# EAGLE design LWK2_MainBoard_Rev_1 (EAGLE 7.6.0)
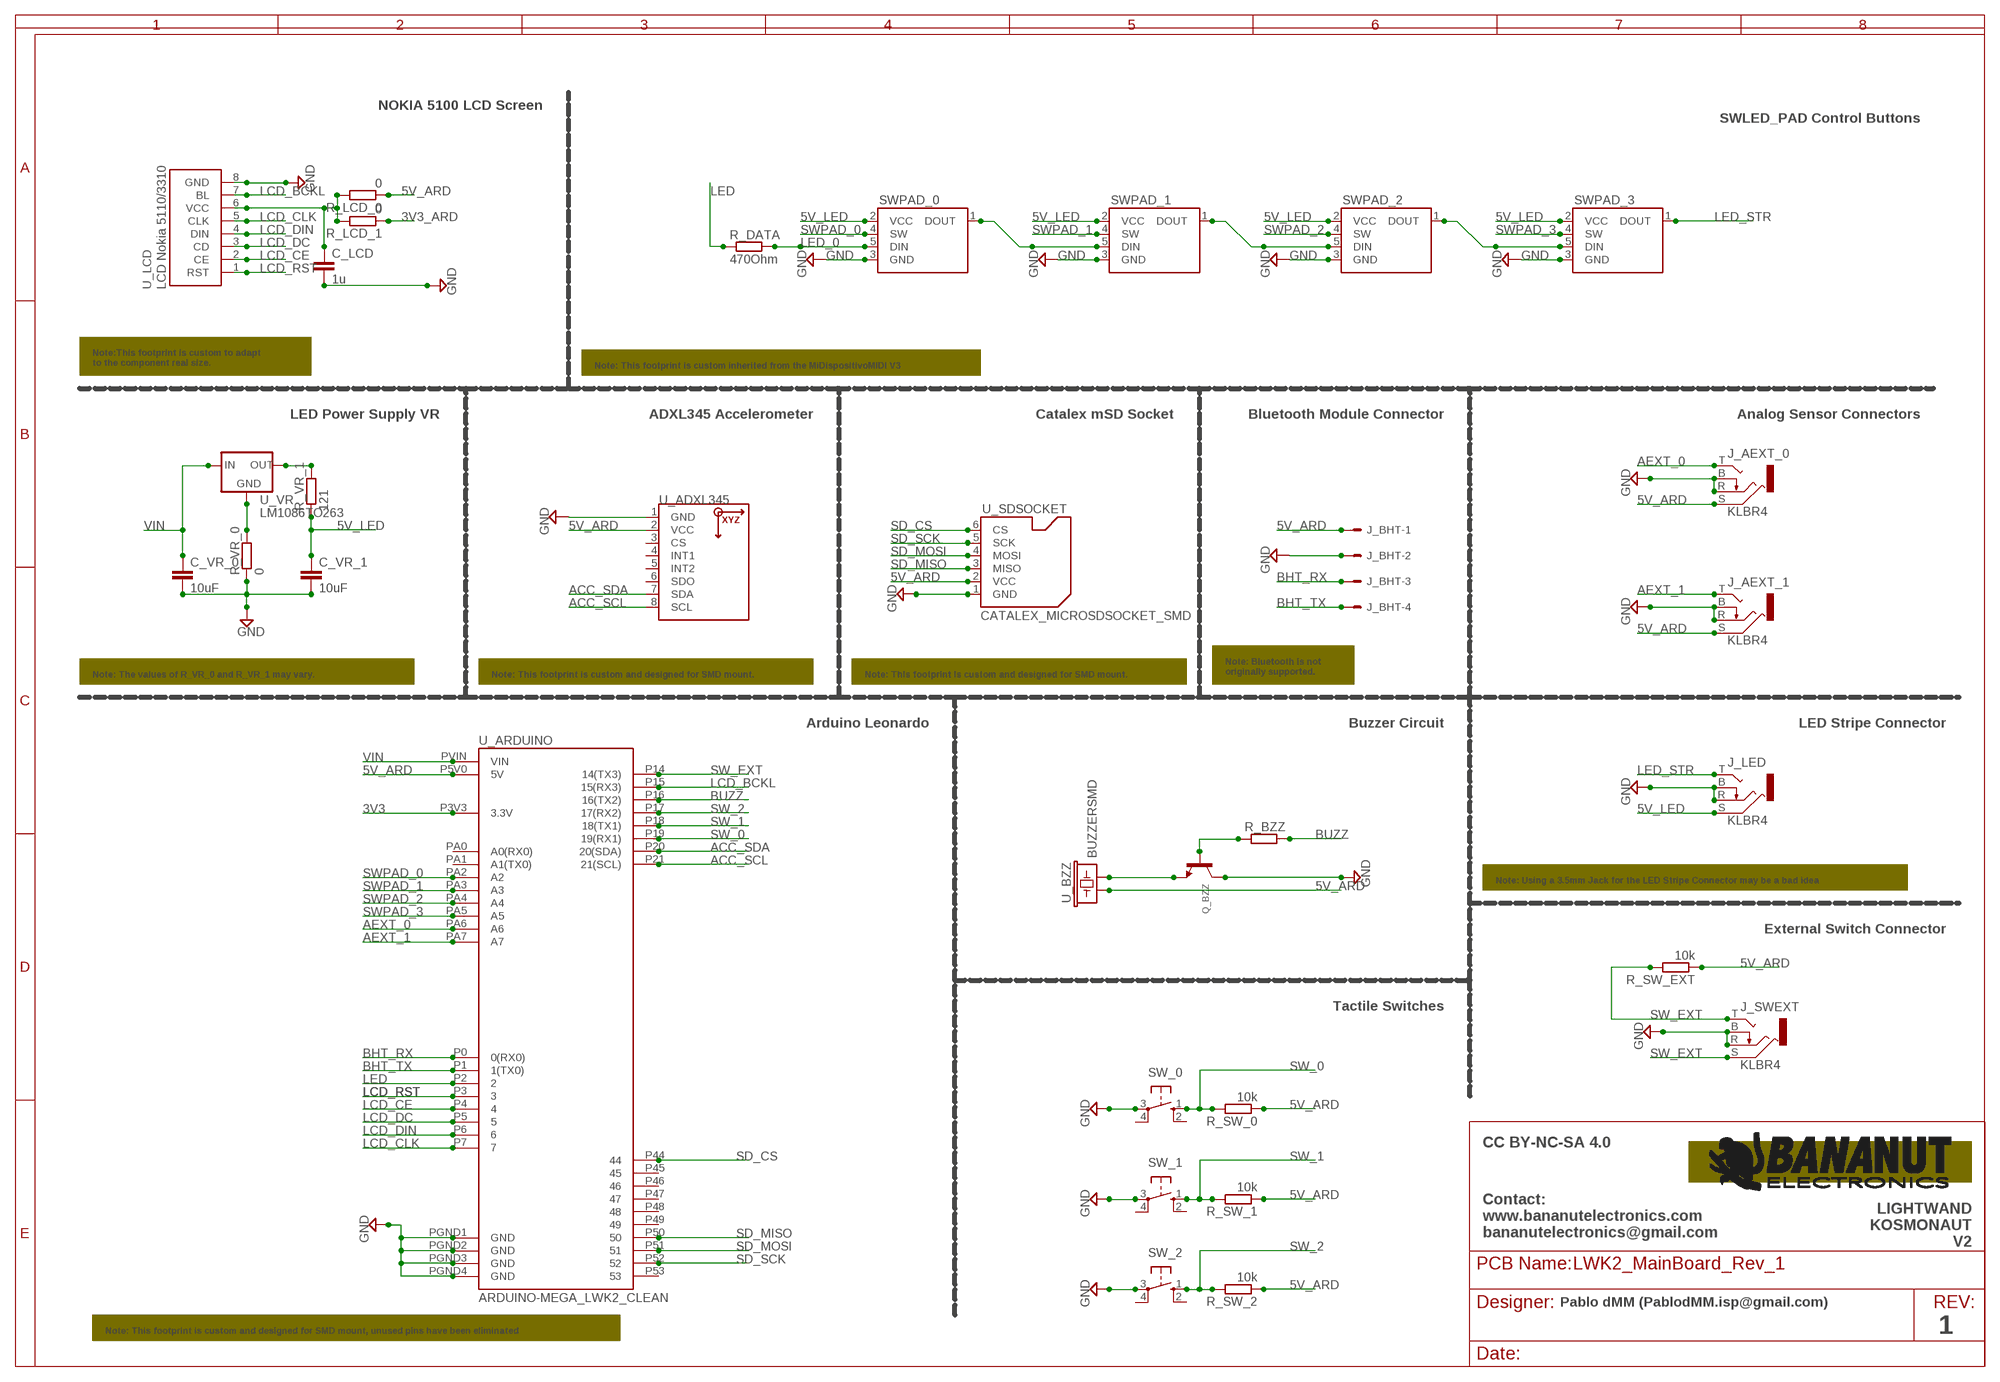
[diagram p0: schematic, sheet 1]

## Parts
C_LCD  1u  C-EUC1206  [C1206]
C_VR_0  10uF  C-EUC1206  [C1206]
C_VR_1  10uF  C-EUC1206  [C1206]
J_AEXT_0  KLBR4  [KLBR4]
J_AEXT_1  KLBR4  [KLBR4]
J_BHT  22-05-7048-04  [7395-04]
J_LED  KLBR4  [KLBR4]
J_SWEXT  KLBR4  [KLBR4]
Q_BZZ  TRANSISTOR_NPNWIDE  [SOT23-WIDE]
R_BZZ  R-EU_R1206  [R1206]
R_DATA  470Ohm  R-EU_R1206  [R1206]
R_LCD_0  0  R-EU_R1206  [R1206]
R_LCD_1  0  R-EU_R1206  [R1206]
R_SW_0  10k  R-EU_R1206  [R1206]
R_SW_1  10k  R-EU_R1206  [R1206]
R_SW_2  10k  R-EU_R1206  [R1206]
R_SW_EXT  10k  R-EU_R1206  [R1206]
R_VR_0  0  R-EU_R1206  [R1206]
R_VR_1  121  R-EU_R1206  [R1206]
SW_0  40-XX-ROUND  [B3F-40XX-ROUND]
SW_1  40-XX-ROUND  [B3F-40XX-ROUND]
SW_2  40-XX-ROUND  [B3F-40XX-ROUND]
SWPAD_0  MDM_V3_LEDPAD  [MDM_V3_LEDPAD]
SWPAD_1  MDM_V3_LEDPAD  [MDM_V3_LEDPAD]
SWPAD_2  MDM_V3_LEDPAD  [MDM_V3_LEDPAD]
SWPAD_3  MDM_V3_LEDPAD  [MDM_V3_LEDPAD]
U_ADXL345  GY-291_ADXL345  [GY-291_ADXL345]
U_ARDUINO  ARDUINO-MEGA_LWK2_CLEAN  [ARDUINO_MEGA_LWK2_CLEAN]
U_BZZ  BUZZERSMD  [BUZZER-CMT1603]
U_LCD  NOKIA5110  [NOKIA5110]
U_SDSOCKET  CATALEX_MICROSDSOCKET_SMD  [CATALEX_MICROSDSOCKET_SMD]
U_VR  LM1086TO263  [TO263]

## Nets
3V3: U_ARDUINO.P3V3(3.3V)
3V3_ARD: R_LCD_1.1
5V_ARD: J_AEXT_0.S J_AEXT_1.S J_BHT.1 R_LCD_0.1 R_SW_0.1 R_SW_1.1 R_SW_2.1 R_SW_EXT.1 U_ADXL345.2(VCC) U_ARDUINO.P5V0(5V) U_BZZ.P$1 U_SDSOCKET.2(VCC)
5V_LED: C_VR_1.1 J_LED.S R_VR_1.1 SWPAD_0.2(VCC) SWPAD_1.2(VCC) SWPAD_2.2(VCC) SWPAD_3.2(VCC)
ACC_SCL: U_ADXL345.8(SCL) U_ARDUINO.P21(21(SCL))
ACC_SDA: U_ADXL345.7(SDA) U_ARDUINO.P20(20(SDA))
AEXT_0: J_AEXT_0.T U_ARDUINO.PA6(A6)
AEXT_1: J_AEXT_1.T U_ARDUINO.PA7(A7)
BHT_RX: J_BHT.3 U_ARDUINO.P0(0(RX0))
BHT_TX: J_BHT.4 U_ARDUINO.P1(1(TX0))
BUZZ: R_BZZ.2 U_ARDUINO.P16(16(TX2))
GND [GND]: C_LCD.2 C_VR_0.2 C_VR_1.2 J_AEXT_0.B J_AEXT_0.R J_AEXT_1.B J_AEXT_1.R J_BHT.2 J_LED.B J_LED.R J_SWEXT.B J_SWEXT.R Q_BZZ.3(C) R_VR_0.1 SW_0.3(P) SW_1.3(P) SW_2.3(P) SWPAD_0.3(GND) SWPAD_1.3(GND) SWPAD_2.3(GND) SWPAD_3.3(GND) U_ADXL345.1(GND) U_ARDUINO.PGND1(GND) U_ARDUINO.PGND2(GND) U_ARDUINO.PGND3(GND) U_ARDUINO.PGND4(GND) U_LCD.8(GND) U_SDSOCKET.1(GND)
LCD_BCKL: U_ARDUINO.P15(15(RX3)) U_LCD.7(BL)
LCD_CE: U_ARDUINO.P4 U_LCD.2(CE)
LCD_CLK: U_ARDUINO.P7 U_LCD.5(CLK)
LCD_DC: U_ARDUINO.P5 U_LCD.3(CD)
LCD_DIN: U_ARDUINO.P6 U_LCD.4(DIN)
LCD_PW: C_LCD.1 R_LCD_0.2 R_LCD_1.2 U_LCD.6(VCC)
LCD_RST: U_ARDUINO.P3 U_LCD.1(RST)
LED: R_DATA.1 U_ARDUINO.P2
LED_0: R_DATA.2 SWPAD_0.5(DIN)
LED_1: SWPAD_0.1(DOUT) SWPAD_1.5(DIN)
LED_2: SWPAD_1.1(DOUT) SWPAD_2.5(DIN)
LED_3: SWPAD_2.1(DOUT) SWPAD_3.5(DIN)
LED_STR: J_LED.T SWPAD_3.1(DOUT)
N$1: R_VR_0.2 U_VR.1(GND)
N$2: R_VR_1.2 U_VR.2(OUT)
N$4: Q_BZZ.2(E) U_BZZ.P$2
N$8: Q_BZZ.1(B) R_BZZ.1
SD_CS: U_ARDUINO.P44 U_SDSOCKET.6(CS)
SD_MISO: U_ARDUINO.P50 U_SDSOCKET.3(MISO)
SD_MOSI: U_ARDUINO.P51 U_SDSOCKET.4(MOSI)
SD_SCK: U_ARDUINO.P52 U_SDSOCKET.5(SCK)
SW_0: R_SW_0.2 SW_0.1(S) U_ARDUINO.P19(19(RX1))
SW_1: R_SW_1.2 SW_1.1(S) U_ARDUINO.P18(18(TX1))
SW_2: R_SW_2.2 SW_2.1(S) U_ARDUINO.P17(17(RX2))
SW_EXT: J_SWEXT.S J_SWEXT.T R_SW_EXT.2 U_ARDUINO.P14(14(TX3))
SWPAD_0: SWPAD_0.4(SW) U_ARDUINO.PA2(A2)
SWPAD_1: SWPAD_1.4(SW) U_ARDUINO.PA3(A3)
SWPAD_2: SWPAD_2.4(SW) U_ARDUINO.PA4(A4)
SWPAD_3: SWPAD_3.4(SW) U_ARDUINO.PA5(A5)
VIN [VCC]: C_VR_0.1 U_ARDUINO.PVIN(VIN) U_VR.3(IN)
Unconnected: SW_0.2(S1) SW_0.4(P1) SW_1.2(S1) SW_1.4(P1) SW_2.2(S1) SW_2.4(P1) U_ARDUINO.P45 U_ARDUINO.P46 U_ARDUINO.P47 U_ARDUINO.P48 U_ARDUINO.P49 U_ARDUINO.P53 U_ARDUINO.PA0(A0(RX0)) U_ARDUINO.PA1(A1(TX0))

## Notes on the sheet
- NOKIA 5100 LCD Screen
- SWLED_PAD Control Buttons
- Note:This footprint is custom to adapt
  to the component real size.
- Note: This footprint is custom inherited from the MiDispositivoMIDI V3
- LED Power Supply VR | ADXL345 Accelerometer | Catalex mSD Socket | Bluetooth Module Connector | Analog Sensor Connectors
- Note: Bluetooth is not
  originally supported.
- Note: The values of R_VR_0 and R_VR_1 may vary. | Note: This footprint is custom and designed for SMD mount. | Note: This footprint is custom and designed for SMD mount.
- Arduino Leonardo | Buzzer Circuit | LED Stripe Connector
- Note: Using a 3.5mm Jack for the LED Stripe Connector may be a bad idea
- External Switch Connector
- Tactile Switches
- CC BY-NC-SA 4.0
- LIGHTWAND
  KOSMONAUT
  V2
- Contact:
  www.bananutelectronics.com
  bananutelectronics@gmail.com
- Pablo dMM (PablodMM.isp@gmail.com)
- 1
- Note: This footprint is custom and designed for SMD mount, unused pins have been eliminated

## Power pins joined to a net without a drawn wire
CS: U_ADXL345.3(CS)
INT1: U_ADXL345.4(INT1)
INT2: U_ADXL345.5(INT2)
SDO: U_ADXL345.6(SDO)

## Library data of the parts
C_LCD C_VR_0 C_VR_1 = resistor:C-EU: CAPACITOR, European symbol
J_AEXT_0 J_AEXT_1 J_LED J_SWEXT = con-lumberg:KLBR4: Jack connectors according to JISC 6560, 3.5 mm Klinkeneinbaukupplung nach JISC 6560, 3,5 mm, 3-polig/ stereo, abgewinkelte Ausführung, mit Öffner, für Leiterplatten Source: Data sheet <http://www.lumberg.com/Produkte/PDFs/KLBR4.pdf>; MPN: KLBR 4; OC_FARNELL: 1217016; OC_NEWARK: 97K2709
J_BHT = con-molex:22-?-04: CONNECTOR wire to board 2.54 mm (.1 inch) pitch header; OC_FARNELL: unknown; OC_NEWARK: unknown
Q_BZZ = microbuilder:TRANSISTOR_NPN: NPN Transistor Transistor (NPN) 500mA 45V - BC817 [Digikey: 568-1631-1-ND] Transistor (NPN) 500mA 45V - BC817,215 [Mouser: 771-BC817-T/R] SOT23-R - SOT23 footprint optimised for use with solder paste and reflow ovens. SOT23-W - SOT23 footprint optimised for hand-soldering (larger pads).
R_BZZ R_DATA R_LCD_0 R_LCD_1 R_SW_0 R_SW_1 R_SW_2 R_SW_EXT R_VR_0 R_VR_1 = resistor:R-EU_: RESISTOR, European symbol
SW_0 SW_1 SW_2 = adafruit:40-XX: OMRON SWITCH
SWPAD_0 SWPAD_1-SWPAD_3 = PdMM_Aux:MDM_V3_LEDPAD: WS2812B - Intelligent control LED integrated light source Technical Specifications: Power Supply Voltage (VDD): 3.5 to 5.3 V Input Voltage (VI): -0.5 to VDD+0.5 V Operating Junction Temperature (Topt): -25°C to +80°C Storage Temperature Range (Tstg): -55°C to +150°C; PROD_ID: DIO-12503
U_ADXL345 = PdMM_Aux:GY-291_ADXL345: WS2812B - GY-291_ADXL345 Technical Specifications: GY-291_ADXL345 ACC Module SMD Fix Mount (!!!) Made for LWK2
U_ARDUINO = SparkFun-Boards:ARDUINO-MEGA_LWK2_CLEAN: Arduino Mega board footprint
U_BZZ = SparkFun:BUZZER: Buzzer 12mm Spark Fun Electronics SKU : Comp-Buzzer
U_LCD = _LCD_Nokia5110:NOKIA5110: Monochrome LCD Module from Nokia 5110/3310 with controller PCD8544. 8 pins x 2,54mm on bottom side. 45,5 mm x 42,5 mm
U_SDSOCKET = PdMM_Aux:CATALEX_MICROSDSOCKET_SMD: WS2812B - CATALEX mSD Socket Technical Specifications: CATALEX mSD Socket Made for LWK2
U_VR = v-reg-2:LM1086

## Net classes
1 GND: width 0.635 mm
2 VCC: width 0.889 mm

## Board
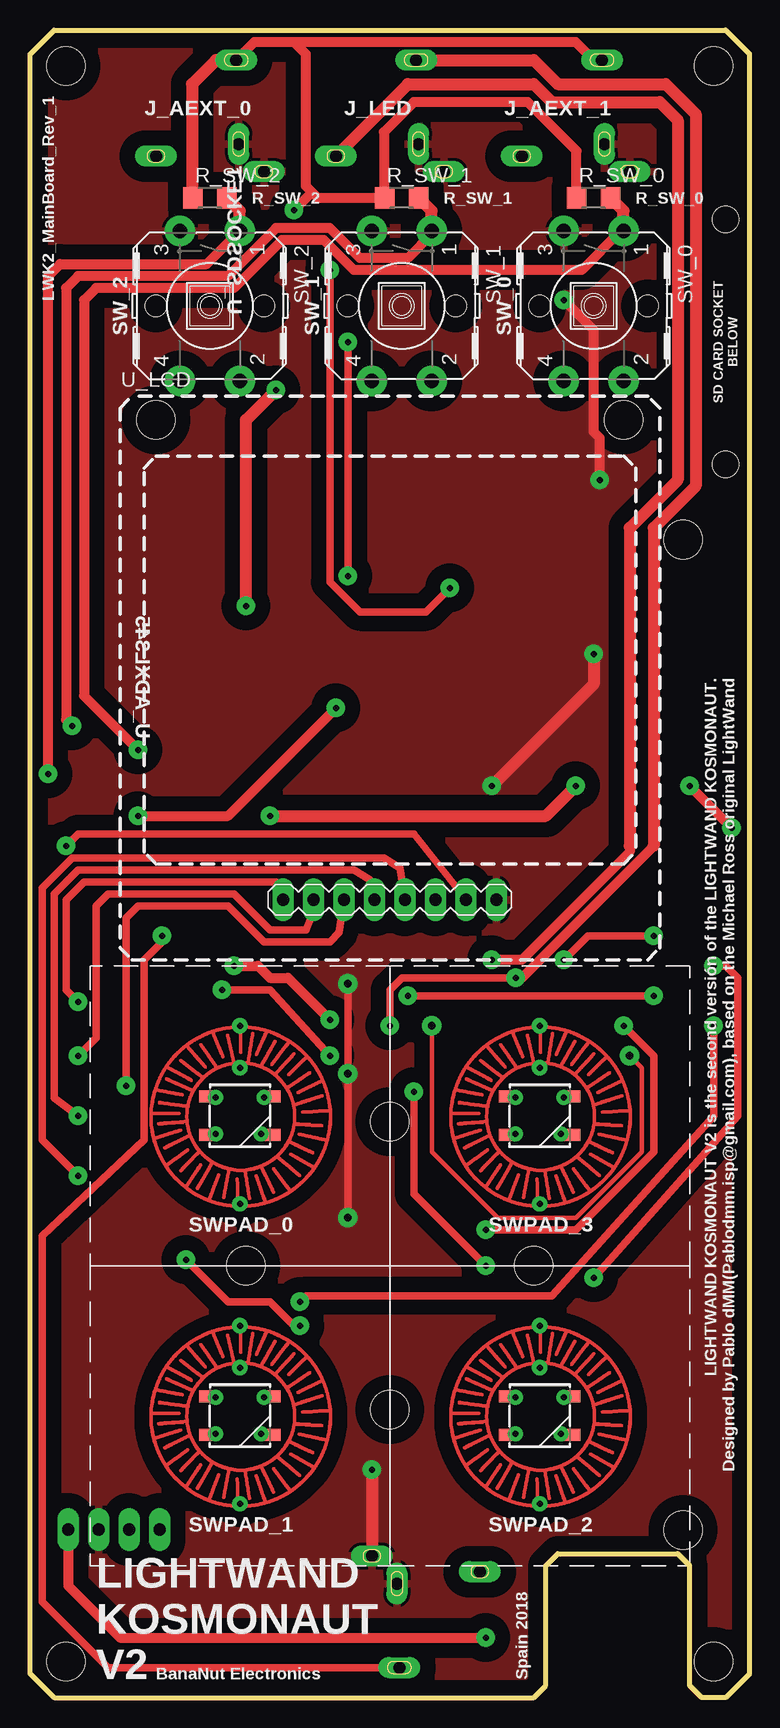
[diagram p1: board, top side]
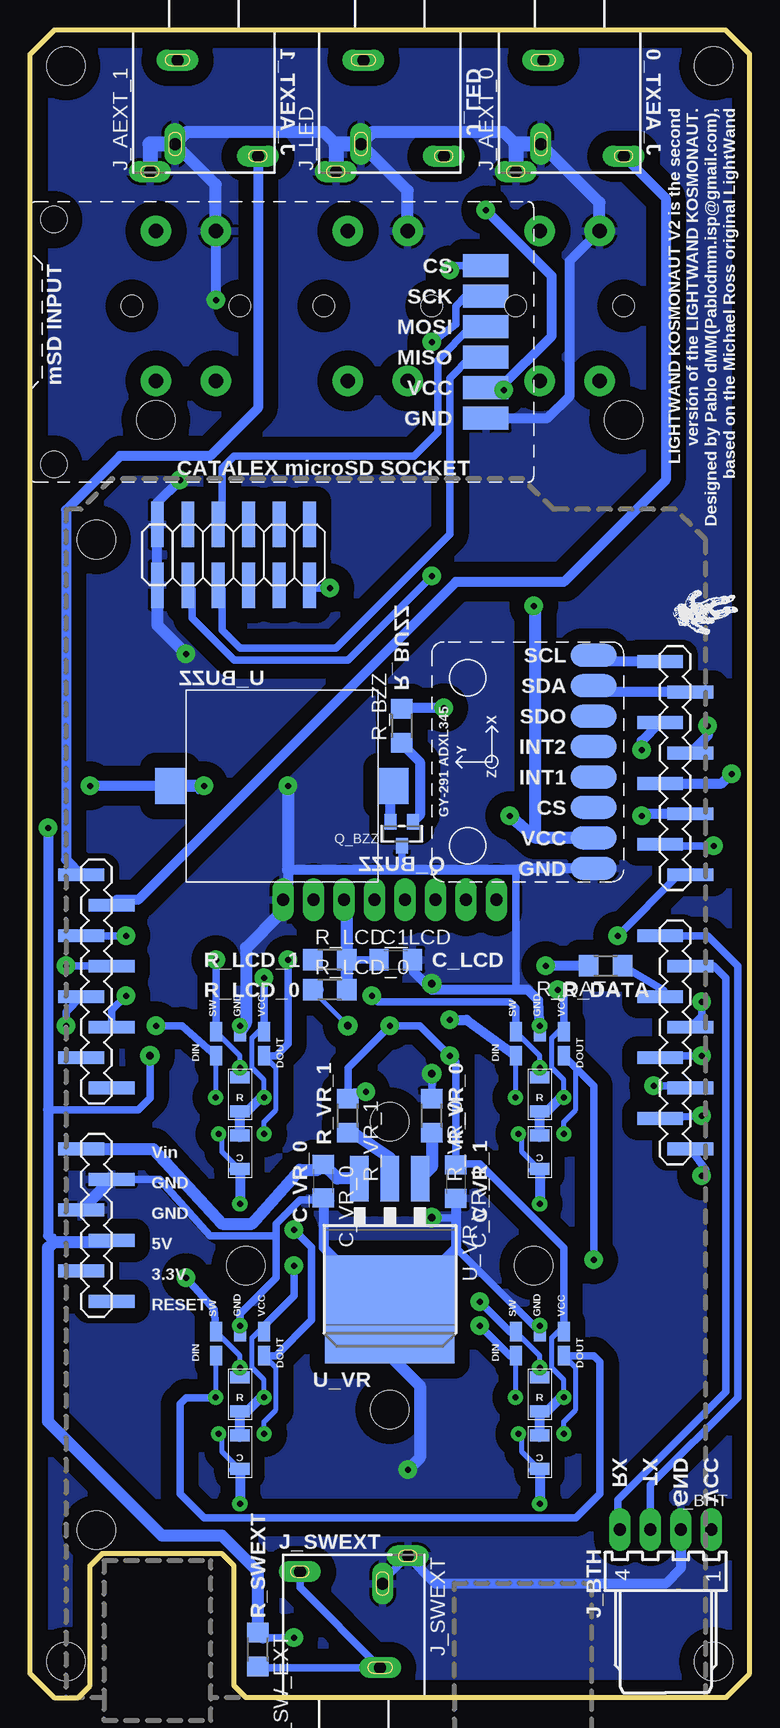
[diagram p2: board, bottom side, seen from below]

Size 60 x 139 mm. Coordinates in mm from the lower left corner, seen from the top.
Outline: 2,0 42,0 43,1 43,11 44,12 54,12 55,11 55,1 56,0 58,0 60,2 60,137 58,139 2,139 0,137 0,2 2,0
Copper layers (1*16): Top 0.035mm / dielectric 1.5mm / Bottom 0.035mm
Design rules "default *": minimum track width 15mil, minimum drill 24mil, track to track 15mil, track to pad 15mil, pad to pad 15mil, via to via 15mil, smd to smd 8mil, copper to edge 40mil, drill to drill 8mil, minimum pad ring 15mil, minimum via ring 20mil, stop-mask expansion 4mil, vias tented up to drill 0mil, thermal gap 10mil
Holes 3.2 mm at 30,24 18,36 42,36 30,48 3,136 57,136 3,3 57,3

### Footprints (pad centres in the part's own frame; a part is rotated, then mirrored left to right if it is on the bottom)
C1206 = smd 1.6 x 1.8: 1 -1.4,0; 2 1.4,0
KLBR4 = drill 1 pad 1.3 long: B -2.4,-3.5; S -2.2,3.5 | drill 1 pad 1.2 long: R -4.5,-5.8; T 4.5,-4.5
7395-04 = drill 1.016 long: 1 3.81,0; 2 1.27,0; 3 -1.27,0; 4 -3.81,0
SOT23-WIDE = smd 1 x 1.27: 1 -0.95,-1; 2 0.95,-1; 3 0,1
R1206 = smd 1.6 x 1.803: 1 -1.422,0; 2 1.422,0
B3F-40XX-ROUND = drill 1.194 pad 2.54: 1 -6.248,2.489; 2 6.248,2.489; 3 -6.248,-2.489; 4 6.248,-2.489 | hole 1.803: 0,-4.496; 0,4.496
MDM_V3_LEDPAD = smd 1 x 1.651 bottom: 1 -2,5; 2 -2,7; 3 0,7; 4 2,7; 5 2,5 | smd 1.651 x 1 bottom: 6 0,-4.44; 7 0,0.37; 8 0,3.17; 9 0,-1.64 | smd 1.651 x 1: A -2.577,1.6; B 2.577,1.6; C -2.577,-1.6; D 2.577,-1.6 | drill 0.5: P$1 0,4; P$2 0,7.5; P$4 -2.032,1.524; P$6 -2.032,-1.524; P$7 2.032,1.524; P$8 1.778,-1.524; P$9 0,-7.366
GY-291_ADXL345 = smd 1.93 x 3.81: 1 8.89,0; 2 6.35,0; 3 3.81,0; 4 1.27,0; 5 -1.27,0; 6 -3.81,0; 7 -6.35,0; 8 -8.89,0
ARDUINO_MEGA_LWK2_CLEAN = smd 1.067 x 3.81 bottom: P0 63.5,49.53; P1 60.96,52.07; P2 58.42,49.53; P3 55.88,52.07; P3V3 35.56,1.27; P4 53.34,49.53; P5 50.8,52.07; P5V0 38.1,3.81; P6 48.26,49.53; P7 45.72,52.07; P14 68.58,52.07; P15 71.12,49.53; P16 73.66,52.07; P17 76.2,49.53; P18 78.74,52.07; P19 81.28,49.53; P20 83.82,52.07; P21 86.36,49.53; PA0 50.8,3.81; PA1 53.34,1.27; PA2 55.88,3.81; PA3 58.42,1.27; PA4 60.96,3.81; PA5 63.5,1.27; PA6 66.04,3.81; PA7 68.58,1.27; PGND1 40.64,1.27; PGND2 43.18,3.81; PRESET 33.02,3.81; PVIN 45.72,1.27 | smd 3.81 x 1.067 bottom: P44 92.71,20.32; P45 97.79,20.32; P46 92.71,17.78; P47 97.79,17.78; P48 92.71,15.24; P49 97.79,15.24; P50 92.71,12.7; P51 97.79,12.7; P52 92.71,10.16; P53 97.79,10.16; PGND3 97.79,7.62; PGND4 92.71,7.62 | hole 3.2: 13.97,2.54; 96.52,2.54
BUZZER-CMT1603 = smd 2.5 x 3: P$1 -9.3,0; P$2 9.3,0
NOKIA5110 = drill 1.016 long: 1 -8.89,-18.5; 2 -6.35,-18.5; 3 -3.81,-18.5; 4 -1.27,-18.5; 5 1.27,-18.5; 6 3.81,-18.5; 7 6.35,-18.5; 8 8.89,-18.5 | hole 3.2: 19.5,21.5; -19.5,21.5
CATALEX_MICROSDSOCKET_SMD = smd 1.93 x 3.81: 1 6.35,0; 2 3.81,0; 3 1.27,0; 4 -1.27,0; 5 -3.81,0; 6 -6.35,0 | hole 2.2: -10.2,-36; 10.2,-36
TO263 = smd 1.524 x 3.81: 1 -2.54,-8.255; 2 0,-8.255; 3 2.54,-8.255 | smd 10.8 x 9: 4 0,2.635

### Placement (x,y rotation side)
C_LCD  29.5,61.5 0 bottom
C_VR_0  35.55,43.05 270 bottom
C_VR_1  24.5,43 270 bottom
J_AEXT_0  15,133 0 bottom
J_AEXT_1  45.5,133 0 bottom
J_BHT  7,14 0 bottom
J_LED  30,133 0 bottom
J_SWEXT  33,6 180 bottom
Q_BZZ  29,72 180 bottom
R_BZZ  29,81 90 bottom
R_DATA  12,61 180 bottom
R_LCD_0  35,59 0 bottom
R_LCD_1  35,61.5 0 bottom
R_SW_0  47,125 0 top
R_SW_1  31,125 0 top
R_SW_2  15,125 0 top
R_SW_EXT  41,4 270 bottom
R_VR_0  26.5,48.5 270 bottom
R_VR_1  33.5,48.5 270 bottom
SW_0  47,116 270 top
SW_1  31,116 270 top
SW_2  15,116 270 top
SWPAD_0  17.5,48.5 0 top
SWPAD_1  17.5,23.5 0 top
SWPAD_2  42.5,23.5 0 top
SWPAD_3  42.5,48.5 0 top
U_ADXL345  13,78 270 bottom
U_ARDUINO  57,0 90 top
U_BZZ  39,76 0 bottom
U_LCD  30,85 0 top
U_SDSOCKET  22,113 270 bottom
U_VR  30,35 180 bottom

### Tracks (layer width: path | path; a pad name or v marks a point on that pad's centre or on a via)
5V_ARD  (via drill 0.5 pad 0.25, 0.61)
  Top 0.381: v33.5,56 33.5,45.5 39,40 45.5,40 51,45.5 51,52.5 v50,53.5
  Top 0.813: v38,5 7.5,5 3.19,9.31 J_BHT.1 | J_AEXT_1.S 47,136.5 45.5,138 22,138 | 22,138 18.7,138 J_AEXT_0.S | 23.5,125.5 24,125 R_SW_1.1 29.5,125.08 29.5,130.5 32,133 41.5,133 45.58,128.92 R_SW_0.1 | 23.5,125.5 23,126 23,137 22,138 | v22,124 23.5,125.5 | v55,76 v58.5,72.5
  Top 1.016: v20,73.5 43,73.5 v45.5,76 | v18,91 18,106.5 v20.5,109 | J_AEXT_0.S 15.5,136.5 13.5,134.5 13.5,125.08 R_SW_2.1
  Bottom 0.381: v33.5,56 36,58.5 R_LCD_0.1 | 58.5,38.5 58,38.5 58,38 | 46,75.5 v45.5,76
  Bottom 0.61: v38,5 40.58,5 | v50,53.5 50,50 51,49 58.5,49
  Bottom 0.813: U_SDSOCKET.2 20.81,109.19 16.5,113.5 16.5,118.5 v22,124 | v45.5,76 v55,76 | v58.5,72.5 58.5,49 58.5,38.5 58,38
  Bottom 1.016: 40.58,5 R_SW_EXT.1 41,10.5 44,13.5 49,13.5 58.5,23 58.5,37.5 58,38 53.29,38 U_ARDUINO.P5V0 | U_ADXL345.2 17.85,71.65 | 17.85,71.65 v20,73.5 | v45.5,76 U_BZZ.P$1 | R_LCD_0.1 36,59 | 17.85,71.65 17.85,90.85 v18,91 | v20.5,109 21.81,109 U_SDSOCKET.2
5V_LED  (via drill 0.5 pad 0.25)
  Top 0.61: v30,56 30,59 31,60 v40.5,60 | v16,59 20,59 v25,53.5 | v38,36 32,42 v32,50.5
  Top 0.813: v40.5,60 41,60 52,71
  Top 1.016: J_LED.S 42,136.5 44,134.5 53,134.5 55.5,132 55.5,101 52,97.5 52,71
  Bottom 0.381: 24.5,44 C_VR_1.1 | 33.5,50 R_VR_1.1
  Bottom 0.61: 33.5,50 33.5,52.5 v30,56 27.5,56 v25,53.5 24.5,53 C_VR_1.1 24.4,44.5 22.5,44.5 15.5,37.5 SWPAD_1.2 | SWPAD_0.2 15.5,58.5 v16,59 | SWPAD_3.2 40.5,59.5 41,60 v40.5,60 | SWPAD_2.2 40.5,31 38,33.5 v38,36 | v32,50.5 32.92,50.5 R_VR_1.1
ACC_SCL
  Bottom 0.813: U_ARDUINO.P21 12.47,86.36 U_ADXL345.8
ACC_SDA
  Bottom 0.813: U_ARDUINO.P20 12.47,83.82 U_ADXL345.7
AEXT_0
  Bottom 0.813: J_AEXT_0.T 7,125 7,101.5 15.5,93 24.5,93 51,66.5 52.73,66.5 U_ARDUINO.PA6
AEXT_1
  Bottom 0.813: J_AEXT_1.T 41,107.5 45,103.5 52.5,103.5 57,99 57,69.85 U_ARDUINO.PA7
BHT_RX
  Bottom 0.61: J_BHT.3 8.27,17.73 1,25 1,61 3.5,63.5 U_ARDUINO.P0
BHT_TX
  Bottom 0.61: U_ARDUINO.P1 2.96,60.96 2,60 2,25.5 11,16.5 11,14.19 J_BHT.4
BUZZ  (via drill 0.5 pad 0.3)
  Top 0.813: v9,73.5 16.5,73.5 v25.5,82.5
  Bottom 0.813: U_ARDUINO.P16 8.84,73.66 v9,73.5 | v25.5,82.5 28.92,82.5 R_BZZ.2
GND  (via drill 0.5 pad 0.25, 0.61)
  Top 0.635: v26.5,40 v26.5,52 v26.5,59.5
  Top 0.813: v47.5,101.5 47.5,105 47,105.5 47,114 v44.5,116.5
  Top 1.016: v28.5,19 J_SWEXT.R | v47,87 47,84.5 v38.5,76
  Bottom 0.61: Q_BZZ.3 29,69 29.5,69 | J_SWEXT.B 30.6,9.7 J_SWEXT.R | 39.5,38.5 39.5,35 42.5,32 SWPAD_2.3 | 39.5,38.5 39.5,39.5 37.5,41.5 35.7,41.5 C_VR_0.2 | U_ARDUINO.PGND2 49.18,43.18 45,38.5 39.5,38.5 | 30,32.5 30,32 30,31 | SWPAD_1.3 24.5,37.5
  Bottom 0.635: v26.5,52 R_VR_0.1 | 24.5,40 v26.5,40 | v26.5,59.5 26.75,59.25 | 19.5,69 19.5,59
  Bottom 0.813: SWPAD_0.3 17.62,58.12 18.5,59 19.5,59 26.5,59 26.75,59.25 28,60.5 28,61.4 C_LCD.2 | U_ADXL345.1 18.89,69.11 19.5,69 29.5,69 38.5,69 38.5,66.94 U_LCD.8 | U_ARDUINO.PGND4 U_ARDUINO.PGND3 49.38,99.62 v47.5,101.5 | J_BHT.2 5.73,10.77 7,9.5 26.2,9.5 J_SWEXT.R | C_VR_1.2 24.5,40 24.5,37.5 30,32 35.5,37.5 35.5,41.6 C_VR_0.2 | v44.5,116.5 44.5,122.24 SW_0.3 | U_SDSOCKET.1 16.85,106.65 15,108.5 15,119.76 SW_2.3
  Bottom 1.016: U_ARDUINO.PGND1 U_ARDUINO.PGND2 | U_LCD.8 39.09,65.41 42,62.5 42,56.23 SWPAD_3.3 | 30,32.5 30,28.5 27.5,26 27.5,20 v28.5,19 | U_ARDUINO.PGND4 49.38,89.38 v47,87 | v38.5,76 38.5,69 | 19.5,129.5 20.5,130.5 31.4,130.5 J_LED.B 28.51,125.61 SW_1.3 | 34.5,129.5 35.5,130.5 46.9,130.5 J_AEXT_1.B 44.51,126.11 SW_0.3 | SW_2.3 12.51,124.61 J_AEXT_0.B
  Bottom 1.27: J_AEXT_0.B 19.5,129.5 J_AEXT_0.R | J_LED.B 34.5,129.5 J_LED.R | J_AEXT_1.B 50,129.5 J_AEXT_1.R
  pour Bottom (isolate 1.27): 2,139 0,137 0,2 2,0 42,0 43,1 43,11 44,12 54,12 55,11 55,1 56,0 58,0 60,2 60,137 58,139
  pour Top (isolate 1.27): 2,139 0,137 0,2 2,0 42,0 43,1 43,11 44,12 54,12 55,11 55,1 56,0 58,0 60,2 60,137 58,139
LCD_BCKL  (via drill 0.5 pad 0.25)
  Top 0.61: U_LCD.7 35.93,67.07 32,72 4,72 v3,71
  Bottom 0.61: v3,71 7.35,71 U_ARDUINO.P15
LCD_CE  (via drill 0.5 pad 0.25)
  Top 0.61: U_LCD.2 23.73,65.73 23,64 20,64 17,67 6.5,67 5.5,66 5.5,55 v4,53.5
  Bottom 0.61: v4,53.5 7.31,53.5 U_ARDUINO.P4
LCD_CLK  (via drill 0.5 pad 0.25)
  Top 0.61: U_LCD.5 30.85,69.15 29.5,70 3.5,70 1,67.5 1,46.5 v4,43.5
  Bottom 0.61: v4,43.5 3.65,44 U_ARDUINO.P7
LCD_DC  (via drill 0.5 pad 0.25)
  Top 0.61: U_LCD.3 25.77,63.77 25,63 19.5,63 16.5,66 9,66 8,65 v8,51
  Bottom 0.61: v8,51 5.13,51 U_ARDUINO.P5
LCD_DIN  (via drill 0.5 pad 0.25)
  Top 0.61: U_LCD.4 28.31,68.19 27,69 4,69 2,67 2,50 v4,48.5
  Bottom 0.61: v4,48.5 4.23,48.5 U_ARDUINO.P6
LCD_PW
  Bottom 0.61: C_LCD.1 33.08,61.5 33.58,61
  Bottom 1.016: R_LCD_0.2 33.58,61 R_LCD_1.2 33.58,65.72 U_LCD.6
LCD_RST  (via drill 0.5 pad 0.25)
  Top 0.61: U_LCD.1 21.09,67.41 20.5,68 4.5,68 3,66.5 3,59 v4,58
  Bottom 0.61: v4,58 4,56.81 U_ARDUINO.P3
LED
  Bottom 0.61: U_ARDUINO.P2 7.16,58.92 R_DATA.1
LED_0  (via drill 0.5 pad 0.25)
  Top 0.813: v17,61 19,61 20,60 21.5,60 v25,56.5
  Bottom 0.813: R_DATA.2 v17,61 | v25,56.5 23.58,56.5 SWPAD_0.5
LED_1  (via drill 0.5 pad 0.25)
  Top 0.61: v22.5,31 22,31 20,33 16.5,33 v13,36.5
  Bottom 0.61: SWPAD_1.5 20,28.5 v22.5,31 | v13,36.5 13,51 SWPAD_0.1
LED_2
  Bottom 0.61: SWPAD_1.1 13,28.5 12.5,28 12.5,17 14.5,15 45.5,15 47.5,17 47.5,24.5 47,25 44.5,25
LED_3  (via drill 0.5 pad 0.25)
  Top 0.61: v38,39 45.5,39 52,45.5 52,53.5 v49.5,56
  Bottom 0.61: v38,39 36.54,37.54 36.54,31.46 39.5,28.5 SWPAD_2.1 | v49.5,56 47.31,56 SWPAD_3.5
LED_STR  (via drill 0.5 pad 0.25)
  Top 0.61: v38.5,61.5 39,61.5
  Top 0.813: 50,71 50,70.5 41,61.5 v38.5,61.5
  Top 1.016: 50,71 50,97.5 54,101.5 54,131.5 52.5,133 43.5,133 42,134.5 31.5,134.5 J_LED.T
  Bottom 0.61: SWPAD_3.1 39.5,53.5 38.5,54.5 v38.5,61.5
N$1
  Bottom 1.016: R_VR_0.2 26.5,44.22 U_VR.1
N$2
  Bottom 1.016: U_VR.2 30,45 32.92,47 R_VR_1.2
N$3
  pour Bottom (isolate 1.27): 2,139 0,137 0,2 2,0 42,0 43,1 43,11 44,12 54,12 55,11 55,1 56,0 58,0 60,2 60,137 58,139
N$4
  Bottom 0.813: Q_BZZ.2 29.95,75.75 U_BZZ.P$2
N$8
  Bottom 0.813: R_BZZ.1 29,79.5 27.5,78 27.5,73.55 Q_BZZ.1
SD_CS  (via drill 0.5 pad 0.25)
  Top 0.61: v25,119 25,93 27.5,90.5 33,90.5 v35,92.5
  Bottom 0.61: U_SDSOCKET.6 24.65,119.35 v25,119 | v35,92.5 36.47,92.5 U_ARDUINO.P44
SD_MISO
  Bottom 0.61: U_SDSOCKET.3 23.27,111.73 25,110 25,97 34.5,87.5 42.5,87.5 44,89 44,92.41 U_ARDUINO.P50
SD_MOSI
  Bottom 0.61: U_SDSOCKET.4 23.23,114.27 26,111.5 26,105.5 28,103.5 43,103.5 44,102.5 44,98.09 U_ARDUINO.P51
SD_SCK  (via drill 0.5 pad 0.25)
  Top 0.61: v26.5,113 v26.5,93.5
  Bottom 0.61: U_SDSOCKET.5 23.69,116.81 24.5,116 24.5,114.5 v26.5,113 | v26.5,93.5 33.5,86.5 43,86.5 46.5,90 46.5,92.37 U_ARDUINO.P52 47,92.55
SW_0  (via drill 0.5 pad 0.25)
  Top 0.813: SW_0.1 49.25,122.25 46,119 27,119 24.5,121.5 21,121.5 17,117.5 5.5,117.5 4.5,116.5 4.5,83.5 v9,79
  Top 1.016: SW_0.1 49.49,123.93 R_SW_0.2
  Bottom 0.813: v9,79 9,79.75 U_ARDUINO.P19
SW_1  (via drill 0.5 pad 0.25)
  Top 0.813: SW_1.1 33.49,121.99 31.5,120 27.5,120 25,122.5 20.5,122.5 16.5,118.5 4,118.5 3,117.5 3,81.5 v3.5,81
  Top 1.016: SW_1.1 33.49,123.93 R_SW_1.2
  Bottom 0.813: v3.5,81 3.5,80.17 U_ARDUINO.P18
SW_2  (via drill 0.5 pad 0.25)
  Top 0.813: v1.5,77 1.5,118.5 2.5,119.5 14.74,119.5 SW_2.1
  Top 1.016: SW_2.1 17.49,123.93 R_SW_2.2
  Bottom 0.813: U_ARDUINO.P17 2.3,76.2 v1.5,77
SW_EXT  (via drill 0.5 pad 0.25)
  Top 0.61: v11,63.5 11,63 9.5,61.5 9.5,46.5 1,38.5 1,8 6.5,2.5 J_SWEXT.S
  Bottom 0.61: R_SW_EXT.2 40.92,2.5 J_SWEXT.S 37.5,9.2 J_SWEXT.T | U_ARDUINO.P14 5.92,68.58 v11,63.5
SWPAD_0  (via drill 0.5 pad 0.25)
  Top 0.61: v52,58.5 v31.5,58.5
  Bottom 0.61: v31.5,58.5 31,58 20,58 19.5,57.5 SWPAD_0.4 | U_ARDUINO.PA2 53.19,57.31 v52,58.5
SWPAD_1  (via drill 0.5 pad 0.25)
  Top 0.61: v57,56 57,48.5 43.5,33.5 23,33.5 v22.5,33
  Bottom 0.61: v57,56 57,57.15 U_ARDUINO.PA3 | SWPAD_1.4 20,30.5 v22.5,33
SWPAD_2  (via drill 0.5 pad 0.25)
  Top 0.61: v47,35 59,48.5 59,60 58,61 v57,61
  Bottom 0.61: SWPAD_2.4 44.66,32.34 v47,35 | v57,61 53.23,61 U_ARDUINO.PA4
SWPAD_3  (via drill 0.5 pad 0.25)
  Top 0.61: v52,63.5 46.5,63.5 v44.5,61.5
  Bottom 0.61: U_ARDUINO.PA5 v52,63.5 | v44.5,61.5 SWPAD_3.4
VIN
  Bottom 1.016: U_VR.3 34.35,43.26 C_VR_0.1 36,44 37.5,44 41.5,39.5 44,39.5 49.72,45.72 U_ARDUINO.PVIN

### Text on the board
_tsilk: LWK2_MainBoard_Rev_1 | J_AEXT_0 | J_LED | J_AEXT_1 | R_SW_2 | R_SW_1 | R_SW_0 | SW_2 | SW_1 | SW_0 | SD CARD SOCKET / BELOW | LIGHTWAND KOSMONAUT V2 is the second versión of the LIGHTWAND KOSMONAUT. / Designed by Pablo dMM(Pablodmm.isp@gmail.com), based on the Michael Ross original LightWand | LIGHTWAND / KOSMONAUT / V2 | BanaNut Electronics | Spain 2018
_bsilk: J_AEXT_0 | J_LED | J_AEXT_1 | LIGHTWAND KOSMONAUT V2 is the second / versión of the LIGHTWAND KOSMONAUT. / Designed by Pablo dMM(Pablodmm.isp@gmail.com), / based on the Michael Ross original LightWand | R_BUZZ | U_BUZZ | Q_BUZZ | C_LCD | R_LCD_1 | R_DATA | R_LCD_0 | R_VR_0 | R_VR_1 | C_VR_1 | C_VR_0 | U_VR | VCC / GND / TX / RX | J_SWEXT | R_SWEXT | J_BTH